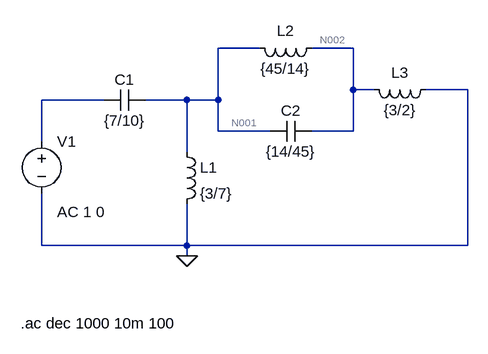
[diagram p0: schematic 1.asc]
1.asc, the LTspice schematic file:
Version 4
SHEET 1 880 680
WIRE 288 48 224 48
WIRE 432 48 368 48
WIRE 432 112 432 48
WIRE 464 112 432 112
WIRE 608 112 544 112
WIRE 48 128 -48 128
WIRE 176 128 112 128
WIRE 224 128 224 48
WIRE 224 128 176 128
WIRE 224 176 224 128
WIRE 304 176 224 176
WIRE 432 176 432 112
WIRE 432 176 368 176
WIRE -48 192 -48 128
WIRE 176 208 176 128
WIRE -48 352 -48 272
WIRE 176 352 176 288
WIRE 176 352 -48 352
WIRE 608 352 608 112
WIRE 608 352 176 352
WIRE 176 368 176 352
FLAG 176 368 0
SYMBOL voltage -48 176 R0
WINDOW 123 24 124 Left 2
WINDOW 39 0 0 Left 0
SYMATTR Value2 AC 1 0
SYMATTR InstName V1
SYMATTR Value ""
SYMBOL cap 112 112 R90
WINDOW 0 0 32 VBottom 2
WINDOW 3 32 32 VTop 2
SYMATTR InstName C1
SYMATTR Value {7/10}
SYMBOL ind 160 192 R0
SYMATTR InstName L1
SYMATTR Value {3/7}
SYMBOL cap 368 160 R90
WINDOW 0 0 32 VBottom 2
WINDOW 3 32 32 VTop 2
SYMATTR InstName C2
SYMATTR Value {14/45}
SYMBOL ind 384 32 R90
WINDOW 0 5 56 VBottom 2
WINDOW 3 32 56 VTop 2
SYMATTR InstName L2
SYMATTR Value {45/14}
SYMBOL ind 560 96 R90
WINDOW 0 5 56 VBottom 2
WINDOW 3 32 56 VTop 2
SYMATTR InstName L3
SYMATTR Value {3/2}
TEXT -80 472 Left 2 !.ac dec 1000 10m 100

The netlist it stands for:
* 1.asc
V1 N003 0 AC 1 0
C1 N001 N003 {7/10}
L1 N001 0 {3/7}
C2 N002 N001 {14/45}
L2 N002 N001 {45/14}
L3 0 N002 {3/2}
.ac dec 1000 10m 100
.backanno
.end

* Results of the author's LTspice run, read from the files saved beside the schematic
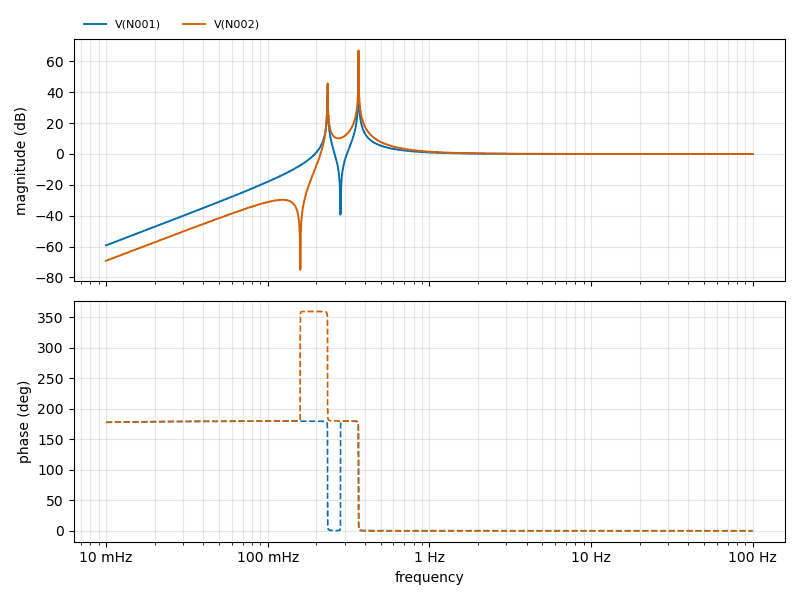
[diagram p1: AC Analysis of 1.asc, plotted from the saved traces]
* AC Analysis, 1 run:
*   V(N001): -59.27 dB at 10 mHz, 0.00 dB at 100 Hz, peak 61.09 dB at 364.8 mHz, 3 dB below the peak at 364.6 mHz and 364.9 mHz
*   V(N002): -69.24 dB at 10 mHz, 0.00 dB at 100 Hz, peak 67.18 dB at 364.8 mHz, 3 dB below the peak at 364.6 mHz and 364.9 mHz